# Altium project DisplayPCB.PrjPcb (part 2 of 3)
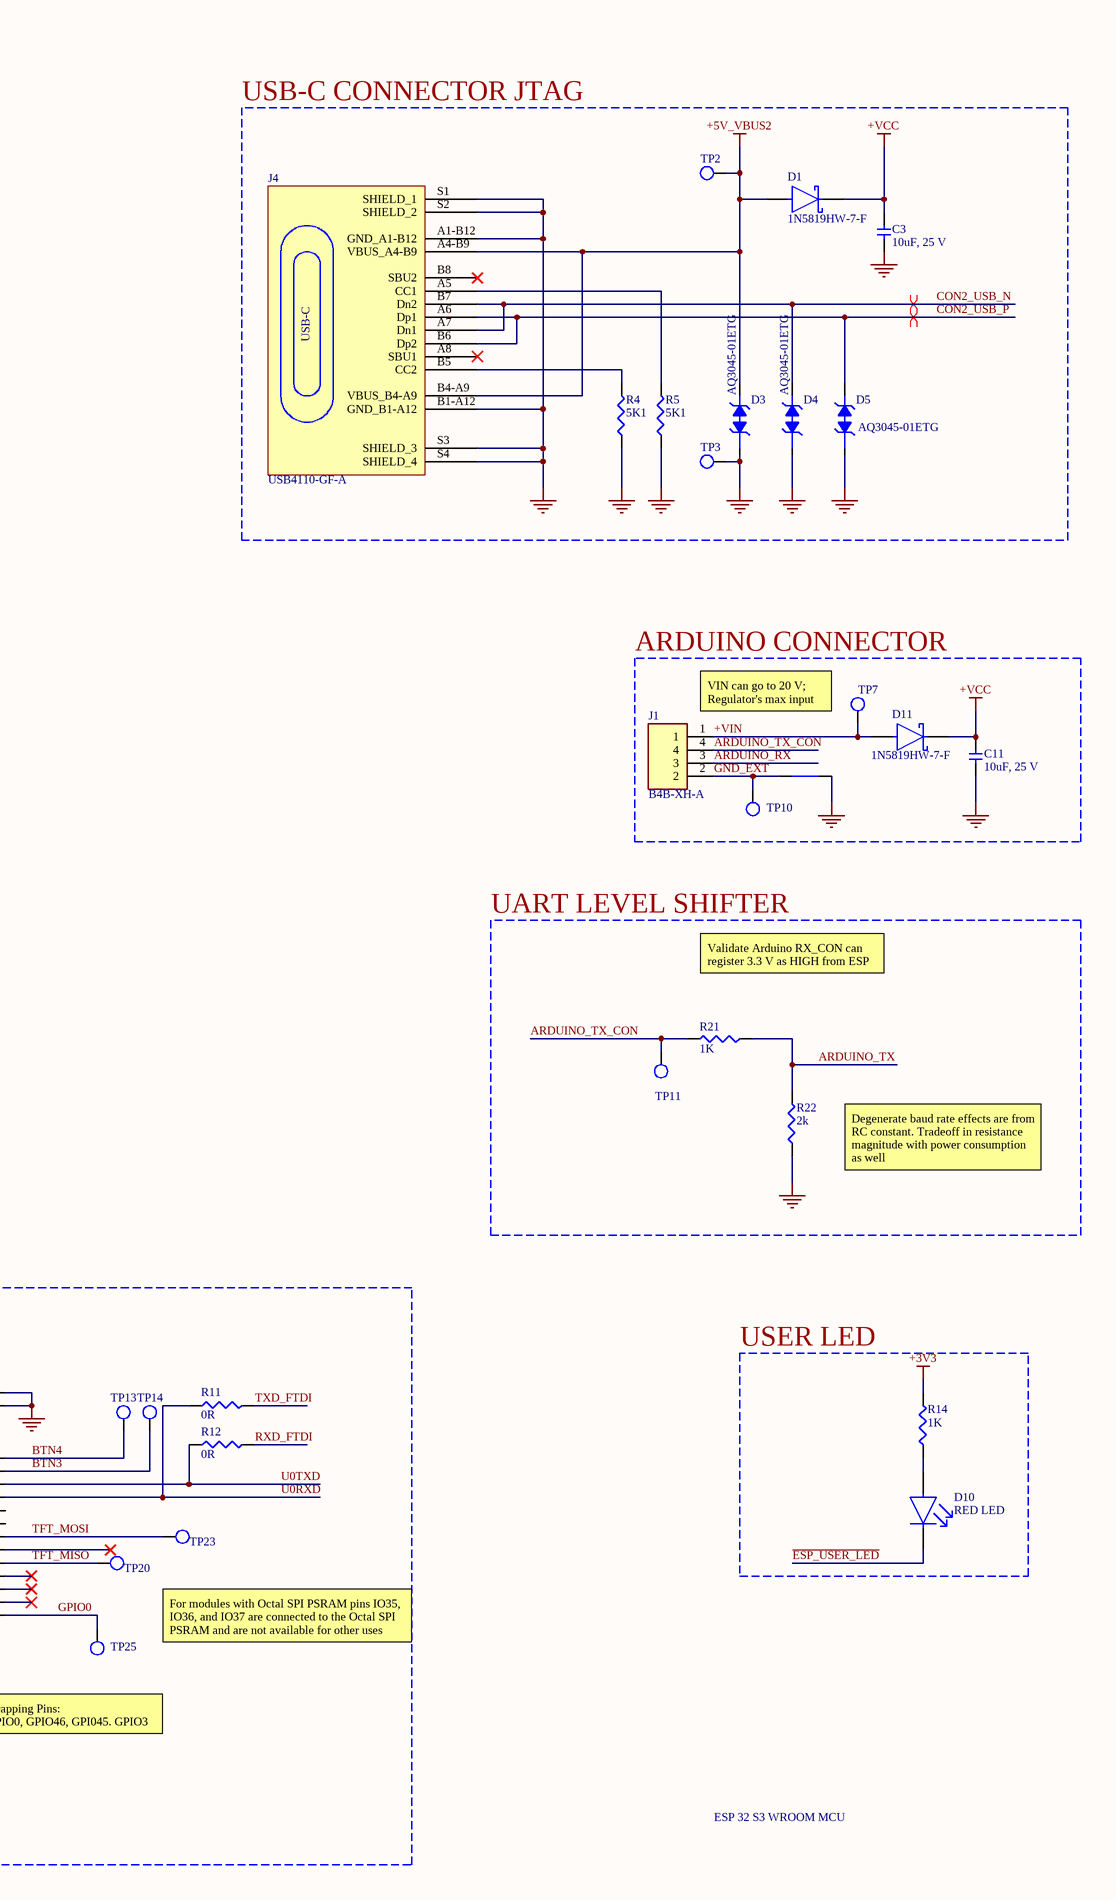
[diagram p4: ESP32_MCU.SchDoc, right]

## Sheet ESP32_MCU.SchDoc (continued)

### Library data of the parts
C1 C5 C7 C15 C17 = 1206B104K500CT: Ceramic Capacitor, Multilayer, Ceramic, 50V, 10% +Tol, 10% -Tol, X7R, 15% TC, 0.1uF, Surface Mount, 1206; Manufacturer: Walsin Technologies; Value: 100nF; Multilayer: Yes; Supplier: Digikey; Supplier Part Number: 1292-1605-1-ND; Manufacturer Part Number: 1206B104K500CT; RoHS: Yes; Category: Ceramic Capacitors; Stock: 1578618; Pricing: 1=0.11, 10=0.061, 100=0.0383, 1000=0.02628 (USD); Mounting Technology: Surface Mount; Pins: 2; Dielectric Material: Ceramic; Package Shape: Rectangular; Case/Package: 1206; Terminal Finish: Nickel; Min Operating Temperature: -55°C; Max Operating Temperature: 125°C; JESD-609 Code: e3; Capacitor Type: Ceramic; Tolerance  (fill in as +-): 10%; Package Style: SMTMeter; Packaging: Tape and Reel; Tolerance (fill in as +-): 10%; Rated DC Voltage (URdc): 50V; Temperature Characteristics Code: X7R; Termination: Wraparound; Length: 3.2mm; Width: 1.6mm; Height: 0.8mm; Reach SVHC Compliant: Yes; RoHS Compliant: Yes; ComponentLink1URL: https://datasheet.ciiva.com:443/pdfs/VipMasterIC/IC/WATC/WATC-S-A0009550342/WATC-S-A0009550342-1.pdf?src-supplier=IHS+Markit; ComponentLink1Description: https://datasheet.ciiva.com:443/pdfs/VipMasterIC/IC/WATC/WATC-S-A0009550342/WATC-S-A0009550342-1.pdf?src-supplier=IHS+Markit; ComponentLink2URL: http://www.farnell.com/datasheets/2340522.pdf?src-supplier=Farnell; ComponentLink2Description: http://www.farnell.com/datasheets/2340522.pdf?src-supplier=Farnell; ComponentLink3URL: http://www.farnell.com/datasheets/2340522.pdf?src-supplier=Newark; ComponentLink3Description: http://www.farnell.com/datasheets/2340522.pdf?src-supplier=Newark; ComponentLink4URL: http://www.passivecomponent.com/wp-content/uploads/2018/10/MLCC.pdf?src-supplier=Digikey; ComponentLink4Description: http://www.passivecomponent.com/wp-content/uploads/2018/10/MLCC.pdf?src-supplier=Digikey; ComponentLink5URL: https://datasheet.octopart.com/1206B104K500CT-Walsin-Technologies-datasheet-85392065.pdf?src-supplier=Element14; ComponentLink5Description: https://datasheet.octopart.com/1206B104K500CT-Walsin-Technologies-datasheet-85392065.pdf?src-supplier=Element14; ComponentLink6URL: http://www.farnell.com/datasheets/1958513.pdf?src-supplier=Element14; ComponentLink6Description: http://www.farnell.com/datasheets/1958513.pdf?src-supplier=Element14; ComponentLink7URL: http://www.farnell.com/datasheets/2340522.pdf?src-supplier=Element14; ComponentLink7Description: http://www.farnell.com/datasheets/2340522.pdf?src-supplier=Element14; ComponentLink8URL: https://www.verical.com/server-webapp/html/getDatasheet?partID=71573&src-supplier=Verical; ComponentLink8Description: https://www.verical.com/server-webapp/html/getDatasheet?partID=71573&src-supplier=Verical; ComponentLink9URL: https://datasheet.octopart.com/1206B104K500CT-Walsin-Technologies-datasheet-128065749.pdf?src-supplier=Future+Electronics; ComponentLink9Description: https://datasheet.octopart.com/1206B104K500CT-Walsin-Technologies-datasheet-128065749.pdf?src-supplier=Future+Electronics; ComponentLink10URL: https://datasheet.octopart.com/1206B104K500CT-Walsin-Technologies-datasheet-62066062.pdf?src-supplier=TME; ComponentLink10Description: https://datasheet.octopart.com/1206B104K500CT-Walsin-Technologies-datasheet-62066062.pdf?src-supplier=TME
C2 C8 = CL31B475KOHNNNE: CAP CER 4.7UF 16V X7R 1206; Manufacturer: Samsung; Dielectric Material: Ceramic; Multilayer: Yes; Tolerance  (fill in as +-): 10%; Supplier: Digikey; Supplier Part Number: 1276-3182-1-ND; Manufacturer Part Number: CL31B475KOHNNNE; RoHS: Yes; Category: Ceramic Capacitors; Stock: 236847; Pricing: 1=0.18, 10=0.103, 100=0.0669, 1000=0.04704 (USD); Mounting Technology: Surface Mount; Pins: 2; Package Shape: Rectangular; Case/Package: 1206; Terminal Finish: Nickel; Min Operating Temperature: -55°C; Max Operating Temperature: 125°C; JESD-609 Code: e3; Value: 4.7uF; Capacitor Type: Ceramic; Package Style: SMTMeter; Packaging: Tape and Reel; Tolerance (fill in as +-): 10%; Rated DC Voltage (URdc): 16V; Temperature Characteristics Code: X7R; Termination: Wraparound; Length: 3.2mm; Width: 1.6mm; Height: 1.8mm; Reach SVHC Compliant: Yes; RoHS Compliant: Yes; ComponentLink1URL: https://datasheet.ciiva.com:443/pdfs/VipMasterIC/IC/SEMS/SEMS-S-A0008522756/SEMS-S-A0008522608-1.pdf?src-supplier=IHS+Markit; ComponentLink1Description: https://datasheet.ciiva.com:443/pdfs/VipMasterIC/IC/SEMS/SEMS-S-A0008522756/SEMS-S-A0008522608-1.pdf?src-supplier=IHS+Markit; ComponentLink2URL: https://datasheet.ciiva.com/15196/getdatasheetpartid-358695-15196064.pdf?src-supplier=Verical; ComponentLink2Description: https://datasheet.ciiva.com/15196/getdatasheetpartid-358695-15196064.pdf?src-supplier=Verical
C3 C4 C9-C11 C14 = TMK316BJ106KL-T: Ceramic Capacitor, Multilayer, Ceramic, 25V, 10% +Tol, 10% -Tol, X5R, 15% TC, 10uF, Surface Mount, 1206; Manufacturer: Taiyo Yuden; Multilayer: Yes; Supplier: Digikey; Supplier Part Number: 587-1337-1-ND; Manufacturer Part Number: TMK316BJ106KL-T; RoHS: Yes; Category: Ceramic Capacitors; Stock: 22102; Pricing: 1=0.12, 10=0.046, 100=0.04, 1000=0.03425 (USD); Mounting Technology: Surface Mount; Pins: 2; Dielectric Material: Ceramic; Package Shape: Rectangular; Case/Package: 1206; Terminal Finish: Nickel; Min Operating Temperature: -55°C; Max Operating Temperature: 85°C; JESD-609 Code: e3; Value: 10uF; Capacitor Type: Ceramic; Tolerance  (fill in as +-): 10%; Package Style: SMTMeter; Packaging: Tape and Reel; Tolerance (fill in as +-): 10%; Rated DC Voltage (URdc): 25V; Temperature Characteristics Code: X5R; Termination: Wraparound; Length: 3.2mm; Width: 1.6mm; Height: 1.6mm; Reach SVHC Compliant: Yes; RoHS Compliant: Yes; ComponentLink1URL: https://datasheet.ciiva.com:443/pdfs/VipMasterIC/IC/TAIY/TAIY-S-A0007939172/TAIY-S-A0007939042-1.pdf?src-supplier=IHS+Markit; ComponentLink1Description: https://datasheet.ciiva.com:443/pdfs/VipMasterIC/IC/TAIY/TAIY-S-A0007939172/TAIY-S-A0007939042-1.pdf?src-supplier=IHS+Markit; ComponentLink2URL: https://datasheet.ciiva.com/7975/1734574-7975841.pdf?src-supplier=Element14; ComponentLink2Description: https://datasheet.ciiva.com/7975/1734574-7975841.pdf?src-supplier=Element14; ComponentLink3URL: https://datasheet.ciiva.com/26936/getdatasheetpartid-782930-26936474.pdf?src-supplier=Verical; ComponentLink3Description: https://datasheet.ciiva.com/26936/getdatasheetpartid-782930-26936474.pdf?src-supplier=Verical; ComponentLink4URL: https://datasheet.ciiva.com/30053/584tmk316bj106kl-t-30053522.pdf?src-supplier=Onlinecomponents.com; ComponentLink4Description: https://datasheet.ciiva.com/30053/584tmk316bj106kl-t-30053522.pdf?src-supplier=Onlinecomponents.com; ComponentLink5URL: https://datasheet.ciiva.com/11601/tmk316bj106kl-t-ss-11601880.pdf?src-supplier=Avnet; ComponentLink5Description: https://datasheet.ciiva.com/11601/tmk316bj106kl-t-ss-11601880.pdf?src-supplier=Avnet; ComponentLink6URL: https://datasheet.ciiva.com/15922/1116tmk316bj106kl-t-15922414.pdf?src-supplier=Onlinecomponents.com; ComponentLink6Description: https://datasheet.ciiva.com/15922/1116tmk316bj106kl-t-15922414.pdf?src-supplier=Onlinecomponents.com; ComponentLink7URL: https://datasheet.ciiva.com/5420/mlcc-all-e-541559-5420143.pdf?src-supplier=Mouser; ComponentLink7Description: https://datasheet.ciiva.com/5420/mlcc-all-e-541559-5420143.pdf?src-supplier=Mouser
C16 = CL31B105KOFNNNE: Ceramic Capacitor, Multilayer, Ceramic, 16V, 10% +Tol, 10% -Tol, X7R, 15% TC, 1uF, Surface Mount, 1206; Manufacturer 1: Samsung; Multilayer: Yes; Supplier 1: Digikey; Manufacturer Part Number 1: CL31B105KOFNNNE; RoHS: Yes; Category: Ceramic Capacitors; Stock 1: 16372; Pricing 1: 1=0.11, 10=0.059, 100=0.037, 1000=0.02531 (USD); Mount: Surface Mount; Number of Pins: 2; Dielectric Material: Ceramic; Package Shape: Rectangular; Size Code: 1206; Terminal Finish: Nickel; Min Operating Temperature: -55°C; Max Operating Temperature: 125°C; JESD-609 Code: e3; Capacitance: 1uF; Capacitor Type: Ceramic; Negative Tolerance: 10%; Package Style: SMTMeter; Packaging: Tape and Reel; Positive Tolerance: 10%; Rated DC Voltage (URdc): 16V; Temperature Characteristics Code: X7R; Termination: Wraparound; Length: 3.2mm; Width: 1.6mm; Height: 1.25mm; Reach SVHC Compliant: Yes; RoHS Compliant: Yes; ComponentLink1URL: https://datasheet.ciiva.com:443/pdfs/VipMasterIC/IC/SEMS/SEMS-S-A0008524868/SEMS-S-A0008524880-1.pdf?src-supplier=IHS+Markit; ComponentLink1Description: https://datasheet.ciiva.com:443/pdfs/VipMasterIC/IC/SEMS/SEMS-S-A0008524868/SEMS-S-A0008524880-1.pdf?src-supplier=IHS+Markit; ComponentLink2URL: https://datasheet.ciiva.com/25798/cl31b105kofnnne-25798673.pdf?src-supplier=Digikey; ComponentLink2Description: https://datasheet.ciiva.com/25798/cl31b105kofnnne-25798673.pdf?src-supplier=Digikey; ComponentLink3URL: https://datasheet.ciiva.com/26838/getdatasheetpartid-358370-26838906.pdf?src-supplier=Verical; ComponentLink3Description: https://datasheet.ciiva.com/26838/getdatasheetpartid-358370-26838906.pdf?src-supplier=Verical; ComponentLink4URL: https://datasheet.ciiva.com/29200/453334-da-01-en-vs-kondensator-1206-29200316.pdf?src-supplier=Conrad; ComponentLink4Description: https://datasheet.ciiva.com/29200/453334-da-01-en-vs-kondensator-1206-29200316.pdf?src-supplier=Conrad; ComponentLink5URL: https://datasheet.ciiva.com/26310/mlcc-catalogdownload2013-eng-26310089.pdf?src-supplier=Distrelec; ComponentLink5Description: https://datasheet.ciiva.com/26310/mlcc-catalogdownload2013-eng-26310089.pdf?src-supplier=Distrelec
D1 D2 D11 = 1N5819HW-7-F: Rectifier Diode, Schottky, 1 Phase, 1 Element, 1A, 40V V(RRM), Silicon; Manufacturer: Diodes; Package Body Material: Plastic; Forward Voltage: 320mV; Non-rep Pk Forward Current-Max: 25A; Number of Elements: 1; Max Power Dissipation: 450mW; Time @ Peak Reflow Temperature-Max (s): 40s; Qualification Status: Not Qualified; Supplier: Digikey; Supplier Part Number: 1N5819HW-FDICT-ND; Manufacturer Part Number: 1N5819HW-7-F; RoHS: Yes; Category: Rectifier Diodes; Stock: 568095; Pricing: 1=0.25, 10=0.17, 100=0.1037, 500=0.09142, 1000=0.08553 (USD); Pins: 2; Diode Element Material: SILICON; Package Shape: Rectangular; Terminal Finish: Tin; Min Operating Temperature: -65°C; Max Operating Temperature: 125°C; JESD-609 Code: e3; Diode Type: RECTIFIER; JESD-30 Code: R-PDSO-G2; Moisture Sensitivity Level: 1; Max Output current: 1A; Package Style: SMALL OUTLINEMeter; Peak Reflow Temperature (Cel): 260°C; Rep Pk Reverse Voltage-Max: 40V; Surface Mount: Yes; Technology: SCHOTTKY; Terminal Form: Gull Wing; Terminal Position: DUAL; Reach SVHC Compliant: Yes; RoHS Compliant: Yes; ComponentLink1URL: https://datasheet.ciiva.com:443/pdfs/VipMasterIC/IC/DIOD/DIOD-S-A0009689747/DIOD-S-A0009691035-1.pdf?src-supplier=IHS+Markit; ComponentLink1Description: https://datasheet.ciiva.com:443/pdfs/VipMasterIC/IC/DIOD/DIOD-S-A0009689747/DIOD-S-A0009691035-1.pdf?src-supplier=IHS+Markit; ComponentLink2URL: https://datasheet.ciiva.com/16303/ds30217-16303296.pdf?src-supplier=Future+Electronics; ComponentLink2Description: https://datasheet.ciiva.com/16303/ds30217-16303296.pdf?src-supplier=Future+Electronics; ComponentLink3URL: https://datasheet.ciiva.com/1177/ds30217-1177089.pdf?src-supplier=Element14; ComponentLink3Description: https://datasheet.ciiva.com/1177/ds30217-1177089.pdf?src-supplier=Element14; ComponentLink4URL: https://datasheet.ciiva.com/912/ds30217-912801.pdf?src-supplier=Digikey; ComponentLink4Description: https://datasheet.ciiva.com/912/ds30217-912801.pdf?src-supplier=Digikey; ComponentLink5URL: https://datasheet.ciiva.com/912/ds30217-912802.pdf?src-supplier=Digikey; ComponentLink5Description: https://datasheet.ciiva.com/912/ds30217-912802.pdf?src-supplier=Digikey; ComponentLink6URL: https://datasheet.ciiva.com/912/ds30217-912803.pdf?src-supplier=Digikey; ComponentLink6Description: https://datasheet.ciiva.com/912/ds30217-912803.pdf?src-supplier=Digikey; ComponentLink7URL: https://datasheet.ciiva.com/8303/ds30217-8303132.pdf?src-supplier=Avnet; ComponentLink7Description: https://datasheet.ciiva.com/8303/ds30217-8303132.pdf?src-supplier=Avnet
D3-D8 = AQ3045-01ETG: Trans Voltage Suppressor Diode, 40W, 5.3V V(RWM), Bidirectional, 1 Element, Silicon, MO-236 / TVS DIODE 5.3VWM 12VC SOD882; Manufacturer 1: Littelfuse; Package Body Material: Plastic; Max Breakdown Voltage: 9V; Min Breakdown Voltage: 6.8V; Number of Elements: 1; Reference Standard: AEC-Q101; Supplier 1: Digikey; Manufacturer Part Number 1: AQ3045-01ETG; RoHS: Yes; Category: TVS Diodes; Stock 1: 14379; Pricing 1: 1=0.46, 10=0.302, 100=0.141, 500=0.134, 1000=0.127, 2000=0.1255, 5000=0.124, 10000=0.111, 20000=0.10638 (USD); Number of Pins: 2; Diode Element Material: SILICON; Package Shape: Rectangular; Min Operating Temperature: -55°C; Max Operating Temperature: 150°C; Polarity: Bidirectional; Diode Type: TRANS VOLTAGE SUPPRESSOR; Non-rep Peak Rev Power Dis-Max: 40W; Package Style: CHIP CARRIERMeter; Rep Pk Reverse Voltage-Max: 5.3V; Surface Mount: Yes; Technology: AVALANCHE; Terminal Form: No Lead; Terminal Position: BOTTOM; Reach SVHC Compliant: Yes; RoHS Compliant: Yes; ComponentLink1URL: https://datasheet.ciiva.com:443/pdfs/VipMasterIC/IC/LFSI/LFSI-S-A0007892042/LFSI-S-A0007892042-1.pdf?src-supplier=IHS+Markit; ComponentLink1Description: https://datasheet.ciiva.com:443/pdfs/VipMasterIC/IC/LFSI/LFSI-S-A0007892042/LFSI-S-A0007892042-1.pdf?src-supplier=IHS+Markit; ComponentLink2URL: http://www.littelfuse.com/~/media/electronics/datasheets/tvs_diode_arrays/littelfuse_tvs_diode_array_aq3045_datasheet.pdf.pdf?src-supplier=Digikey; ComponentLink2Description: http://www.littelfuse.com/~/media/electronics/datasheets/tvs_diode_arrays/littelfuse_tvs_diode_array_aq3045_datasheet.pdf.pdf?src-supplier=Digikey; ComponentLink3URL: https://www.littelfuse.com/~/media/electronics/datasheets/tvs_diode_arrays/littelfuse_tvs_diode_array_aq3045_datasheet.pdf.pdf?src-supplier=Digikey; ComponentLink3Description: https://www.littelfuse.com/~/media/electronics/datasheets/tvs_diode_arrays/littelfuse_tvs_diode_array_aq3045_datasheet.pdf.pdf?src-supplier=Digikey; ComponentLink4URL: https://datasheet.octopart.com/AQ3045-01ETG-Littelfuse-datasheet-101609968.pdf?src-supplier=Farnell; ComponentLink4Description: https://datasheet.octopart.com/AQ3045-01ETG-Littelfuse-datasheet-101609968.pdf?src-supplier=Farnell; ComponentLink5URL: https://datasheet.octopart.com/AQ3045-01ETG-Littelfuse-datasheet-140480283.pdf?src-supplier=Future+Electronics; ComponentLink5Description: https://datasheet.octopart.com/AQ3045-01ETG-Littelfuse-datasheet-140480283.pdf?src-supplier=Future+Electronics
D9 = LTST-C171KGKT: Green 571nm LED Indication - Discrete 2V 0805 (2012 Metric); Manufacturer: Vishay Lite-On; Shape: Rectangular; Lens Style: WATER CLEAR; Forward Current: 30mA; Luminous Intensity-Nom: 35mcd; Channels: 1; Optoelectronic Device Type: SINGLE COLOR LED; Viewing Angle: 130°; Overall Height: 0.8mm; Supplier: Digikey; Supplier Part Number: 160-1426-1-ND; Manufacturer Part Number: LTST-C171KGKT; RoHS: Yes; Stock: 117516; Pricing: 1=0.15, 10=0.105, 100=0.0723, 500=0.05736, 1000=0.05238 (USD); Mounting Technology: Surface Mount; Pins: 2; Color: Green; Terminal Finish: Tin; Min Operating Temperature: -55°C; Max Operating Temperature: 85°C; JESD-609 Code: e3; Packaging: Tape and Reel; Size: 1.4mm; Terminal Pitch: 2.5mm; Reach SVHC Compliant: Yes; RoHS Compliant: Yes; ComponentLink1URL: https://datasheet.ciiva.com:443/pdfs/VipMasterIC/IC/LITE/LITES11816/LITES11816-1.pdf?src-supplier=IHS+Markit; ComponentLink1Description: https://datasheet.ciiva.com:443/pdfs/VipMasterIC/IC/LITE/LITES11816/LITES11816-1.pdf?src-supplier=IHS+Markit; ComponentLink2URL: https://datasheet.ciiva.com/11774/0900766b80dc0298-11774377.pdf?src-supplier=Rs; ComponentLink2Description: https://datasheet.ciiva.com/11774/0900766b80dc0298-11774377.pdf?src-supplier=Rs; ComponentLink3URL: https://datasheet.ciiva.com/12400/lite-on-ltst-c171kgkt-187692-12400799.pdf?src-supplier=Mouser; ComponentLink3Description: https://datasheet.ciiva.com/12400/lite-on-ltst-c171kgkt-187692-12400799.pdf?src-supplier=Mouser; ComponentLink4URL: https://datasheet.ciiva.com/16200/lite-on20ltst-c171kgkt-16200100.pdf?src-supplier=Future+Electronics; ComponentLink4Description: https://datasheet.ciiva.com/16200/lite-on20ltst-c171kgkt-16200100.pdf?src-supplier=Future+Electronics; ComponentLink5URL: https://datasheet.ciiva.com/15118/getdatasheetpartid-214542-15118099.pdf?src-supplier=Verical; ComponentLink5Description: https://datasheet.ciiva.com/15118/getdatasheetpartid-214542-15118099.pdf?src-supplier=Verical; ComponentLink6URL: https://datasheet.ciiva.com/2110/s-110-ltst-c171kgkt-2110072.pdf?src-supplier=Digikey; ComponentLink6Description: https://datasheet.ciiva.com/2110/s-110-ltst-c171kgkt-2110072.pdf?src-supplier=Digikey; ComponentLink7URL: https://datasheet.ciiva.com/2110/s-110-ltst-c171kgkt-2110073.pdf?src-supplier=Digikey; ComponentLink7Description: https://datasheet.ciiva.com/2110/s-110-ltst-c171kgkt-2110073.pdf?src-supplier=Digikey; ComponentLink8URL: https://datasheet.ciiva.com/2110/s-110-ltst-c171kgkt-2110074.pdf?src-supplier=Digikey; ComponentLink8Description: https://datasheet.ciiva.com/2110/s-110-ltst-c171kgkt-2110074.pdf?src-supplier=Digikey
D10 = LTST-C171KRKT: Red 631nm LED Indication - Discrete 2V 0805 (2012 Metric); Manufacturer: Vishay Lite-On; Shape: Rectangular; Lens Style: WATER CLEAR; Forward Current: 30mA; Luminous Intensity-Nom: 54mcd; Channels: 1; Optoelectronic Device Type: SINGLE COLOR LED; Viewing Angle: 130°; Overall Height: 0.8mm; Supplier: Digikey; Supplier Part Number: 160-1427-1-ND; Manufacturer Part Number: LTST-C171KRKT; RoHS: Yes; Category: LEDs; Stock: 198518; Pricing: 1=0.15, 10=0.105, 100=0.0723, 500=0.05736, 1000=0.05238 (USD); Mounting Technology: Surface Mount; Pins: 2; Color: Red; Terminal Finish: Tin; Min Operating Temperature: -55°C; Max Operating Temperature: 85°C; JESD-609 Code: e3; Packaging: Tape and Reel; Size: 1.4mm; Terminal Pitch: 2.5mm; Reach SVHC Compliant: Yes; RoHS Compliant: Yes; ComponentLink1URL: https://datasheet.ciiva.com:443/pdfs/VipMasterIC/IC/LITE/LITES11817/LITES11817-1.pdf?src-supplier=IHS+Markit; ComponentLink1Description: https://datasheet.ciiva.com:443/pdfs/VipMasterIC/IC/LITE/LITES11817/LITES11817-1.pdf?src-supplier=IHS+Markit; ComponentLink2URL: https://datasheet.ciiva.com/11775/0900766b80dc0299-11775643.pdf?src-supplier=Rs; ComponentLink2Description: https://datasheet.ciiva.com/11775/0900766b80dc0299-11775643.pdf?src-supplier=Rs; ComponentLink3URL: https://datasheet.ciiva.com/12403/lite-on-ltst-c171krkt-187201-12403781.pdf?src-supplier=Mouser; ComponentLink3Description: https://datasheet.ciiva.com/12403/lite-on-ltst-c171krkt-187201-12403781.pdf?src-supplier=Mouser; ComponentLink4URL: https://datasheet.ciiva.com/16444/lite-on20ltst-c171krkt-16444779.pdf?src-supplier=Future+Electronics; ComponentLink4Description: https://datasheet.ciiva.com/16444/lite-on20ltst-c171krkt-16444779.pdf?src-supplier=Future+Electronics; ComponentLink5URL: https://datasheet.ciiva.com/2110/s-110-ltst-c171krkt-2110066.pdf?src-supplier=Digikey; ComponentLink5Description: https://datasheet.ciiva.com/2110/s-110-ltst-c171krkt-2110066.pdf?src-supplier=Digikey; ComponentLink6URL: https://datasheet.ciiva.com/2110/s-110-ltst-c171krkt-2110067.pdf?src-supplier=Digikey; ComponentLink6Description: https://datasheet.ciiva.com/2110/s-110-ltst-c171krkt-2110067.pdf?src-supplier=Digikey; ComponentLink7URL: https://datasheet.ciiva.com/2110/s-110-ltst-c171krkt-2110068.pdf?src-supplier=Digikey; ComponentLink7Description: https://datasheet.ciiva.com/2110/s-110-ltst-c171krkt-2110068.pdf?src-supplier=Digikey; Supplier 1: Digikey; Supplier Part Number 1: 160-1415-1-ND
J1 = 455-B4B-XH-A-ND: CONN HEADER VERT 4POS 2.5MM; Manufacturer: JST; Manufacturer Part Number: S4B-PH-K-S; Supplier: Digikey; Supplier Part Number: 455-1721-ND; RoHS: Yes; Category: Headers and Wire Housings; Stock: 152539; Pricing: 1=0.19, 10=0.158, 100=0.134, 500=0.1196, 1000=0.11389, 5000=0.10165, 10000=0.09679 (USD); ComponentLink1URL: https://media.digikey.com/pdf/Data%20Sheets/JST%20PDFs/PH%20Series.pdf?src-supplier=Digikey; ComponentLink1Description: https://media.digikey.com/pdf/Data%20Sheets/JST%20PDFs/PH%20Series.pdf?src-supplier=Digikey; Supplier 1: Digikey; Supplier Part Number 1: 455-B4B-XH-A-ND
J3 J4 = USB4110-GF-A: USB-C (USB TYPE-C) USB 2.0 Receptacle Connector 24 (16+8 Dummy) Position Surface Mount, Right Angle; Manufacturer 1: Global Connector Technology; Supplier 1: Digikey; Manufacturer Part Number 1: USB4110-GF-A; RoHS: No; Category: USB Connectors; Stock 1: 16644; Pricing 1: 1=1.24, 10=1.006, 25=0.9276, 50=0.8722, 100=0.8201, 250=0.75604, 500=0.71098 (USD); ComponentLink1URL: https://datasheet.octopart.com/USB4110-GF-A-Global-Connector-Technology-datasheet-179886649.pdf?src-supplier=Future+Electronics; ComponentLink1Description: https://datasheet.octopart.com/USB4110-GF-A-Global-Connector-Technology-datasheet-179886649.pdf?src-supplier=Future+Electronics; ComponentLink2URL: https://gct.co/files/drawings/usb4110.pdf?src-supplier=Digikey; ComponentLink2Description: https://gct.co/files/drawings/usb4110.pdf?src-supplier=Digikey; ComponentLink3URL: https://datasheet.octopart.com/USB4110-GF-A-GCT-datasheet-166929324.pdf?src-supplier=SOS+electronic; ComponentLink3Description: https://datasheet.octopart.com/USB4110-GF-A-GCT-datasheet-166929324.pdf?src-supplier=SOS+electronic; ComponentLink4URL: https://datasheet.octopart.com/USB4110-GF-A-GCT-datasheet-166933377.pdf?src-supplier=TME; ComponentLink4Description: https://datasheet.octopart.com/USB4110-GF-A-GCT-datasheet-166933377.pdf?src-supplier=TME
NT1-NT3 NT6 NT8 = NetTie_SMD: Net TIE SMD
Q1 Q2 = SS8050-G: Bipolar (BJT) Transistor NPN 25 V 1.5 A 100MHz 300 mW Surface Mount SOT-23-3; Manufacturer: Comchip; Supplier: Digikey; Supplier Part Number: 641-1790-1-ND; Manufacturer Part Number: SS8050-G; RoHS: Yes; Category: Transistors; Stock: 152644; Pricing: 1=0.24, 10=0.148, 100=0.0921, 500=0.06754, 1000=0.05958 (USD); Reach SVHC Compliant: Yes; RoHS Compliant: Yes; ComponentLink1URL: https://datasheet.ciiva.com:443/pdfs/VipMasterIC/IC/COMC/COMC-S-A0004994192/COMC-S-A0004994192-1.pdf?src-supplier=IHS+Markit; ComponentLink1Description: https://datasheet.ciiva.com:443/pdfs/VipMasterIC/IC/COMC/COMC-S-A0004994192/COMC-S-A0004994192-1.pdf?src-supplier=IHS+Markit; ComponentLink2URL: http://www.comchiptech.com/admin/files/product/SS8050-G RevA181526.pdf?src-supplier=Digikey; ComponentLink2Description: http://www.comchiptech.com/admin/files/product/SS8050-G RevA181526.pdf?src-supplier=Digikey
R1 R2 = CRCW080527R4FKEA: RES SMD 27.4 OHM 1% 1/8W 0805; Manufacturer: Vishay; Power: 125mW; Rated Temperature: 70°C; Value: 27.4R; Working Voltage: 150V; Temperature Coefficient (ppm/Cel): 100; Package Height: 0.45mm; Package Length: 2mm; Package Width: 1.25mm; Reference Standard: AEC-Q200; Supplier: Digikey; Supplier Part Number: 541-27.4CCT-ND; Manufacturer Part Number: CRCW080527R4FKEA; RoHS: Yes; Category: Chip SMD Resistors; Stock: 71015; Pricing: 1=0.1, 10=0.039, 50=0.0248, 100=0.0208, 500=0.0143, 1000=0.01238 (USD); Mounting Technology: Surface Mount; Pins: 2; Package Shape: Rectangular; Case/Package: 0805; Terminal Finish: Nickel; Min Operating Temperature: -55°C; Max Operating Temperature: 155°C; Tolerance: 1%; JESD-609 Code: e3; Resistor Type: FIXED RESISTOR; Construction: Chip; Packaging: Tape and Reel; Technology: METAL GLAZE/THICK FILM; Termination: Wraparound; RoHS Compliant: Yes; Reach SVHC Compliant: Yes; ComponentLink1URL: https://datasheet.ciiva.com:443/pdfs/VipMasterIC/IC/VISH/VISH-S-A0007266705/VISH-S-A0007266705-1.pdf?src-supplier=IHS+Markit; ComponentLink1Description: https://datasheet.ciiva.com:443/pdfs/VipMasterIC/IC/VISH/VISH-S-A0007266705/VISH-S-A0007266705-1.pdf?src-supplier=IHS+Markit; ComponentLink2URL: https://datasheet.ciiva.com/11818/0900766b80d98b26-11818212.pdf?src-supplier=Rs; ComponentLink2Description: https://datasheet.ciiva.com/11818/0900766b80d98b26-11818212.pdf?src-supplier=Rs; ComponentLink3URL: https://datasheet.ciiva.com/22708/1697337-22708364.pdf?src-supplier=Element14; ComponentLink3Description: https://datasheet.ciiva.com/22708/1697337-22708364.pdf?src-supplier=Element14; ComponentLink4URL: https://datasheet.ciiva.com/2525/dcrcwe3-2525740.pdf?src-supplier=Digikey; ComponentLink4Description: https://datasheet.ciiva.com/2525/dcrcwe3-2525740.pdf?src-supplier=Digikey; ComponentLink5URL: https://datasheet.ciiva.com/2525/dcrcwe3-2525741.pdf?src-supplier=Digikey; ComponentLink5Description: https://datasheet.ciiva.com/2525/dcrcwe3-2525741.pdf?src-supplier=Digikey; ComponentLink6URL: https://datasheet.ciiva.com/2525/dcrcwe3-2525742.pdf?src-supplier=Digikey; ComponentLink6Description: https://datasheet.ciiva.com/2525/dcrcwe3-2525742.pdf?src-supplier=Digikey; ComponentLink7URL: https://datasheet.ciiva.com/5547/dcrcwe3-109170-5547413.pdf?src-supplier=Mouser; ComponentLink7Description: https://datasheet.ciiva.com/5547/dcrcwe3-109170-5547413.pdf?src-supplier=Mouser; ComponentLink8URL: https://datasheet.ciiva.com/7725/125364-7725886.pdf?src-supplier=Element14; ComponentLink8Description: https://datasheet.ciiva.com/7725/125364-7725886.pdf?src-supplier=Element14; ComponentLink9URL: https://datasheet.ciiva.com/7732/1697337-7732095.pdf?src-supplier=Element14; ComponentLink9Description: https://datasheet.ciiva.com/7732/1697337-7732095.pdf?src-supplier=Element14; ComponentLink10URL: https://datasheet.ciiva.com/16435/dcrcw-16435916.pdf?src-supplier=Future+Electronics; ComponentLink10Description: https://datasheet.ciiva.com/16435/dcrcw-16435916.pdf?src-supplier=Future+Electronics
R3 R11 R12 R15 R16 = CR0805AJ/-000EAS: 0 Ohms Jumper Chip Resistor 0805 (2012 Metric) Anti-Sulfur, Automotive AEC-Q200, Moisture Resistant Thick Film; Manufacturer: Bourns; Supplier: Digikey; Supplier Part Number: CR0805AJ/-000EASCT-ND; Manufacturer Part Number: CR0805AJ/-000EAS; RoHS: Yes; Category: Chip SMD Resistors; Stock: 34544; Pricing: 1=0.1, 10=0.034, 50=0.0212, 100=0.0177, 500=0.01208, 1000=0.01043 (USD); ComponentLink1URL: https://datasheet.ciiva.com:443/pdfs/VipMasterIC/IC/BOUR/BOUR-S-A0008933277/BOUR-S-A0008933277-1.pdf?src-supplier=IHS+Markit; ComponentLink1Description: https://datasheet.ciiva.com:443/pdfs/VipMasterIC/IC/BOUR/BOUR-S-A0008933277/BOUR-S-A0008933277-1.pdf?src-supplier=IHS+Markit; ComponentLink2URL: https://www.bourns.com/docs/product-datasheets/crxxxxa-as.pdf?src-supplier=Digikey; ComponentLink2Description: https://www.bourns.com/docs/product-datasheets/crxxxxa-as.pdf?src-supplier=Digikey; ComponentLink3URL: https://datasheet.octopart.com/CR0805AJ--000EAS-Bourns-datasheet-166097895.pdf?src-supplier=Electro+Sonic; ComponentLink3Description: https://datasheet.octopart.com/CR0805AJ--000EAS-Bourns-datasheet-166097895.pdf?src-supplier=Electro+Sonic
R4-R7 = RC0805JR-075K1L: RES 5.1K OHM 5% 1/8W 0805; Manufacturer: Yageo; Rated Temperature: 70°C; Working Voltage: 150V; Temperature Coefficient (ppm/Cel): 100; Package Height: 0.5mm; Package Length: 2mm; Package Width: 1.25mm; Additional Feature: LASER TRIMMABLE; Power: 125mW; Value: 5.1kR; RoHS: Yes; Category: Chip SMD Resistors; Package Shape: Rectangular; Terminal Finish: Nickel; Min Operating Temperature: -55°C; Max Operating Temperature: 155°C; Tolerance: 5%; JESD-609 Code: e3; Resistor Type: FIXED RESISTOR; Construction: Chip; Packaging: Tape and Reel; Technology: METAL GLAZE/THICK FILM; Termination: Wraparound; Reach SVHC Compliant: Yes; RoHS Compliant: Yes; ComponentLink1URL: https://datasheet.ciiva.com:443/pdfs/VipMasterIC/IC/YAGO/YAGO-S-A0008145938/YAGO-S-A0008145938-1.pdf?src-supplier=IHS+Markit; ComponentLink1Description: https://datasheet.ciiva.com:443/pdfs/VipMasterIC/IC/YAGO/YAGO-S-A0008145938/YAGO-S-A0008145938-1.pdf?src-supplier=IHS+Markit; ComponentLink2URL: https://datasheet.ciiva.com/2456/pyu-r-int-thick-7-2456155.pdf?src-supplier=Digikey; ComponentLink2Description: https://datasheet.ciiva.com/2456/pyu-r-int-thick-7-2456155.pdf?src-supplier=Digikey; ComponentLink3URL: https://datasheet.ciiva.com/2456/pyu-r-int-thick-7-2456156.pdf?src-supplier=Digikey; ComponentLink3Description: https://datasheet.ciiva.com/2456/pyu-r-int-thick-7-2456156.pdf?src-supplier=Digikey; ComponentLink4URL: https://datasheet.ciiva.com/2456/pyu-r-int-thick-7-2456157.pdf?src-supplier=Digikey; ComponentLink4Description: https://datasheet.ciiva.com/2456/pyu-r-int-thick-7-2456157.pdf?src-supplier=Digikey; Supplier: Digikey; Supplier Part Number: 311-5.1KARCT-ND; Manufacturer Part Number: RC0805JR-075K1L; Stock: 555886; Pricing: 1=0.1, 10=0.008, 50=0.0072, 100=0.0061 (USD); Mounting Technology: Surface Mount; Pins: 2; Case/Package: 0805; ComponentLink5URL: https://datasheet.ciiva.com/12577/rc0805-12577711.pdf?src-supplier=Mouser; ComponentLink5Description: https://datasheet.ciiva.com/12577/rc0805-12577711.pdf?src-supplier=Mouser
R8 = RC0805JR-075K1L: RES 5.1K OHM 5% 1/8W 0805; Manufacturer: Yageo; Additional Feature: LASER TRIMMABLE; Power: 125mW; Rated Temperature: 70°C; Value: 5.1kR; Working Voltage: 150V; Temperature Coefficient (ppm/Cel): 100; Package Height: 0.5mm; Package Length: 2mm; Package Width: 1.25mm; Supplier: Digikey; Supplier Part Number: 311-5.1KARCT-ND; Manufacturer Part Number: RC0805JR-075K1L; RoHS: Yes; Category: Chip SMD Resistors; Stock: 555886; Pricing: 1=0.1, 10=0.008, 50=0.0072, 100=0.0061 (USD); Mounting Technology: Surface Mount; Pins: 2; Package Shape: Rectangular; Case/Package: 0805; Terminal Finish: Nickel; Min Operating Temperature: -55°C; Max Operating Temperature: 155°C; Tolerance: 5%; JESD-609 Code: e3; Resistor Type: FIXED RESISTOR; Construction: Chip; Packaging: Tape and Reel; Technology: METAL GLAZE/THICK FILM; Termination: Wraparound; Reach SVHC Compliant: Yes; RoHS Compliant: Yes; ComponentLink1URL: https://datasheet.ciiva.com:443/pdfs/VipMasterIC/IC/YAGO/YAGO-S-A0008145938/YAGO-S-A0008145938-1.pdf?src-supplier=IHS+Markit; ComponentLink1Description: https://datasheet.ciiva.com:443/pdfs/VipMasterIC/IC/YAGO/YAGO-S-A0008145938/YAGO-S-A0008145938-1.pdf?src-supplier=IHS+Markit; ComponentLink2URL: https://datasheet.ciiva.com/2456/pyu-r-int-thick-7-2456155.pdf?src-supplier=Digikey; ComponentLink2Description: https://datasheet.ciiva.com/2456/pyu-r-int-thick-7-2456155.pdf?src-supplier=Digikey; ComponentLink3URL: https://datasheet.ciiva.com/2456/pyu-r-int-thick-7-2456156.pdf?src-supplier=Digikey; ComponentLink3Description: https://datasheet.ciiva.com/2456/pyu-r-int-thick-7-2456156.pdf?src-supplier=Digikey; ComponentLink4URL: https://datasheet.ciiva.com/2456/pyu-r-int-thick-7-2456157.pdf?src-supplier=Digikey; ComponentLink4Description: https://datasheet.ciiva.com/2456/pyu-r-int-thick-7-2456157.pdf?src-supplier=Digikey; ComponentLink5URL: https://datasheet.ciiva.com/12577/rc0805-12577711.pdf?src-supplier=Mouser; ComponentLink5Description: https://datasheet.ciiva.com/12577/rc0805-12577711.pdf?src-supplier=Mouser
R9 R10 R13 = RMCF0805FT10K0: Fixed Resistor, Metal Glaze/thick Film, 0.125W, 10000ohm, 150V, 1% +/-Tol, 100ppm/Cel, Surface Mount, 0805; Manufacturer 1: Stackpole Electronics; Rated Power Dissipation (P): 125mW; Rated Temperature: 70°C; Resistance: 10kR; Temperature Coefficient (ppm/Cel): 100; Package Height: 0.5mm; Package Length: 2mm; Package Width: 1.25mm; Reference Standard: AEC-Q200; Supplier 1: Digikey; Manufacturer Part Number 1: RMCF0805FT10K0; RoHS: Yes; Category: Chip SMD Resistors; Stock 1: 928178; Pricing 1: 1=0.1, 10=0.025, 100=0.012, 1000=0.00658, 2500=0.00564 (USD); Mount: Surface Mount; Number of Pins: 2; Package Shape: Rectangular; Size Code: 0805; Terminal Finish: Nickel; Min Operating Temperature: -55°C; Max Operating Temperature: 155°C; Tolerance: 1%; JESD-609 Code: e3; Resistor Type: FIXED RESISTOR; Construction: Rectangular; Packaging: Tape and Reel; Technology: METAL GLAZE/THICK FILM; Termination: Wraparound; Working Voltage: 150V; Reach SVHC Compliant: Yes; RoHS Compliant: Yes; ComponentLink1URL: https://datasheet.ciiva.com:443/pdfs/VipMasterIC/IC/SEIE/SEIE-S-A0009541969/SEIE-S-A0009541969-1.pdf?src-supplier=IHS+Markit; ComponentLink1Description: https://datasheet.ciiva.com:443/pdfs/VipMasterIC/IC/SEIE/SEIE-S-A0009541969/SEIE-S-A0009541969-1.pdf?src-supplier=IHS+Markit; ComponentLink2URL: https://datasheet.ciiva.com/15193/getdatasheetpartid-362046-15193525.pdf?src-supplier=Verical; ComponentLink2Description: https://datasheet.ciiva.com/15193/getdatasheetpartid-362046-15193525.pdf?src-supplier=Verical
R14 R21 = RC0805FR-071KL: RES 1K OHM 1% 1/8W 0805; Manufacturer: Yageo; Additional Feature: LASER TRIMMABLE; Power: 125mW; Rated Temperature: 70°C; Value: 1kR; Working Voltage: 150V; Temperature Coefficient (ppm/Cel): 100; Package Height: 0.5mm; Package Length: 2mm; Package Width: 1.25mm; Supplier: Digikey; Supplier Part Number: 311-1.00KCRCT-ND; Manufacturer Part Number: RC0805FR-071KL; RoHS: Yes; Category: Chip SMD Resistors; Stock: 932567; Pricing: 1=0.1, 10=0.012, 100=0.0092, 1000=0.00714, 5000=0.00408, 10000=0.00396, 15000=0.00374, 25000=0.00356 (USD); Mounting Technology: Surface Mount; Pins: 2; Package Shape: Rectangular; Case/Package: 0805; Terminal Finish: Nickel; Min Operating Temperature: -55°C; Max Operating Temperature: 155°C; Tolerance: 1%; JESD-609 Code: e3; Resistor Type: FIXED RESISTOR; Construction: Chip; Packaging: Tape and Reel; Technology: METAL GLAZE/THICK FILM; Termination: Wraparound; Reach SVHC Compliant: Yes; RoHS Compliant: Yes; ComponentLink1URL: https://datasheet.ciiva.com:443/pdfs/VipMasterIC/IC/YAGO/YAGO-S-A0008145938/YAGO-S-A0008145938-1.pdf?src-supplier=IHS+Markit; ComponentLink1Description: https://datasheet.ciiva.com:443/pdfs/VipMasterIC/IC/YAGO/YAGO-S-A0008145938/YAGO-S-A0008145938-1.pdf?src-supplier=IHS+Markit
R22 = CRCW08052K00FKEA: Fixed Resistor, Metal Glaze/thick Film, 0.125W, 2000ohm, 150V, 1% +/-Tol, 100ppm/Cel, Surface Mount, 0805; Manufacturer: Vishay; Power: 125mW; Value: 2kR; Temperature Coefficient (ppm/Cel): 100; Rated Temperature: 70°C; Package Height: 0.45mm; Package Length: 2mm; Package Width: 1.25mm; Reference Standard: AEC-Q200; Supplier: Digikey; Supplier Part Number: 541-2.00KCCT-ND; Manufacturer Part Number: CRCW08052K00FKEA; RoHS: Yes; Category: Chip SMD Resistors; Stock: 21507; Pricing: 1=0.1, 10=0.042, 100=0.0217, 1000=0.01279, 2500=0.0108 (USD); Mounting Technology: Surface Mount; Pins: 2; Case/Package: 0805; Terminal Finish: Nickel; Package Shape: Rectangular; Min Operating Temperature: -55°C; Max Operating Temperature: 155°C; Tolerance: 1%; Resistor Type: FIXED RESISTOR; Packaging: Tape and Reel; Working Voltage: 150V; Technology: METAL GLAZE/THICK FILM; Termination: Wraparound; Construction: Chip; JESD-609 Code: e3; RoHS Compliant: Yes; Reach SVHC Compliant: Yes; ComponentLink1URL: https://datasheet.ciiva.com:443/pdfs/VipMasterIC/IC/VISH/VISH-S-A0007266705/VISH-S-A0007266705-1.pdf?src-supplier=IHS+Markit; ComponentLink1Description: https://datasheet.ciiva.com:443/pdfs/VipMasterIC/IC/VISH/VISH-S-A0007266705/VISH-S-A0007266705-1.pdf?src-supplier=IHS+Markit; ComponentLink2URL: https://datasheet.ciiva.com/9093/dcrcwe3-9093501.pdf?src-supplier=Avnet; ComponentLink2Description: https://datasheet.ciiva.com/9093/dcrcwe3-9093501.pdf?src-supplier=Avnet; ComponentLink3URL: https://datasheet.ciiva.com/2467/dcrcwe3-2467164.pdf?src-supplier=Digikey; ComponentLink3Description: https://datasheet.ciiva.com/2467/dcrcwe3-2467164.pdf?src-supplier=Digikey; ComponentLink4URL: https://datasheet.ciiva.com/2467/dcrcwe3-2467165.pdf?src-supplier=Digikey; ComponentLink4Description: https://datasheet.ciiva.com/2467/dcrcwe3-2467165.pdf?src-supplier=Digikey; ComponentLink5URL: https://datasheet.ciiva.com/2467/dcrcwe3-2467166.pdf?src-supplier=Digikey; ComponentLink5Description: https://datasheet.ciiva.com/2467/dcrcwe3-2467166.pdf?src-supplier=Digikey; ComponentLink6URL: https://datasheet.ciiva.com/16772/70201119-16772086.pdf?src-supplier=Allied+Electronics; ComponentLink6Description: https://datasheet.ciiva.com/16772/70201119-16772086.pdf?src-supplier=Allied+Electronics; ComponentLink7URL: https://datasheet.ciiva.com/16199/dcrcwe3-16199147.pdf?src-supplier=Future+Electronics; ComponentLink7Description: https://datasheet.ciiva.com/16199/dcrcwe3-16199147.pdf?src-supplier=Future+Electronics; ComponentLink8URL: https://datasheet.ciiva.com/5547/dcrcwe3-109170-5547611.pdf?src-supplier=Mouser; ComponentLink8Description: https://datasheet.ciiva.com/5547/dcrcwe3-109170-5547611.pdf?src-supplier=Mouser; ComponentLink9URL: https://datasheet.ciiva.com/15158/getdatasheetpartid-246953-15158870.pdf?src-supplier=Verical; ComponentLink9Description: https://datasheet.ciiva.com/15158/getdatasheetpartid-246953-15158870.pdf?src-supplier=Verical; ComponentLink10URL: https://datasheet.ciiva.com/7673/1697337-7673343.pdf?src-supplier=Element14; ComponentLink10Description: https://datasheet.ciiva.com/7673/1697337-7673343.pdf?src-supplier=Element14; ComponentLink11URL: https://datasheet.ciiva.com/7673/1720486-7673482.pdf?src-supplier=Element14; ComponentLink11Description: https://datasheet.ciiva.com/7673/1720486-7673482.pdf?src-supplier=Element14; ComponentLink12URL: https://datasheet.ciiva.com/7673/1720486-7673483.pdf?src-supplier=Element14; ComponentLink12Description: https://datasheet.ciiva.com/7673/1720486-7673483.pdf?src-supplier=Element14
SW1 SW2 = PTS645SH50SMTR92 LFS: Tactile Switch SPST-NO Top Actuated Surface Mount; Manufacturer 1: ITT C&K; Manufacturer Part Number 1: PTS645SM43SMTR92LFS; Actuator Type: Pushbutton; Contact Current(DC)-Max: 50mA; Contact DC Max Rating R Load: 0.05A@12VDC; Contact Resistance: 0.1mR; Contact Voltage(DC)-Max: 12V; Dielectric Withstand Volts: 250VACV; Insulation Resistance: 100GR; PCB Hole Count: 4; Switch Action: MOMENTARY; Switch Function: SPST; Switch Type: Keypad; Body Breadth: 5.9944mm; Body Height: 3.4544mm; RoHS: Yes; Category: Tactile Switches; Stock 1: 178618; Pricing 1: 1=0.37, 10=0.299, 25=0.2756, 100=0.243, 250=0.22348, 500=0.2096 (USD); Mount: Surface Mount; Terminal Finish: Silver; Min Operating Temperature: -20°C; Max Operating Temperature: 60°C; JESD-609 Code: e4; Termination: Solder; Body Length or Diameter: 5.9944mm; Terminal Length: 0.138inch; Reach SVHC Compliant: Yes; RoHS Compliant: Yes; ComponentLink1URL: https://datasheet.ciiva.com:443/pdfs/VipMasterIC/IC/CKCI/CKCI-S-A0001796527/CKCI-S-A0001796842-1.pdf?src-supplier=IHS+Markit; ComponentLink1Description: https://datasheet.ciiva.com:443/pdfs/VipMasterIC/IC/CKCI/CKCI-S-A0001796527/CKCI-S-A0001796842-1.pdf?src-supplier=IHS+Markit; ComponentLink2URL: https://datasheet.ciiva.com/29903/getdatasheetpartid-786341-29903846.pdf?src-supplier=Verical; ComponentLink2Description: https://datasheet.ciiva.com/29903/getdatasheetpartid-786341-29903846.pdf?src-supplier=Verical; ComponentLink3URL: https://datasheet.ciiva.com/29931/getdatasheetpartid-764615-29931183.pdf?src-supplier=Verical; ComponentLink3Description: https://datasheet.ciiva.com/29931/getdatasheetpartid-764615-29931183.pdf?src-supplier=Verical; ComponentLink4URL: https://datasheet.ciiva.com/14920/pts645-14920733.pdf?src-supplier=Digikey; ComponentLink4Description: https://datasheet.ciiva.com/14920/pts645-14920733.pdf?src-supplier=Digikey; ComponentLink5URL: https://datasheet.ciiva.com/14920/pts645-14920734.pdf?src-supplier=Digikey; ComponentLink5Description: https://datasheet.ciiva.com/14920/pts645-14920734.pdf?src-supplier=Digikey; ComponentLink6URL: https://datasheet.ciiva.com/14920/pts645-14920735.pdf?src-supplier=Digikey; ComponentLink6Description: https://datasheet.ciiva.com/14920/pts645-14920735.pdf?src-supplier=Digikey; Supplier 1: Digikey; Supplier Part Number 1: CKN9085CT-ND
TP1-TP14 TP16-TP26 TP30 TP32 = CMP-108-0001-3: Generic Test Point
U1 = ESP32-S3-WROOM-1(N16R8): RF TXRX MOD BT WIFI PCB TH SMD; Manufacturer: Espressif Systems; Supplier: Digikey; Supplier Part Number: 1965-ESP32-S3-WROOM-1-N16R8CT-ND; Manufacturer Part Number: ESP32-S3-WROOM-1(N16R8); RoHS: No; Category: LDO; Stock: 2632; Pricing: 1=3.9, 650=3.90002 (USD); ComponentLink1URL: https://datasheet.octopart.com/ESP32-S3-WROOM-1-N16R8-Espressif-Systems-datasheet-165560563.pdf?src-supplier=TME; ComponentLink1Description: https://datasheet.octopart.com/ESP32-S3-WROOM-1-N16R8-Espressif-Systems-datasheet-165560563.pdf?src-supplier=TME
U2 = FT231XS-R: IC USB SERIAL FULL UART 20SSOP; Manufacturer: FTDI; Package Body Material: Plastic; Package Equivalence Code: SSOP20,.25; Power Supplies: 3.3/5V; Max Supply Current: 8.4mA; Max Supply Voltage: 5.5V; Min Supply Voltage: 2.97V; Nominal Supply Voltage: 5V; Qualification Status: Not Qualified; Supplier: Digikey; Supplier Part Number: 768-1129-6-ND; Manufacturer Part Number: FT231XS-R; RoHS: Yes; Category: Interface ICs; Stock: 24743; Pricing: 1=2.34, 25=2.27, 100=2.2, 250=2, 500=1.825 (USD); Case/Package: SSOP; Pins: 20; Package Shape: Rectangular; Terminal Finish: Tin; Min Operating Temperature: -40°C; Max Operating Temperature: 85°C; JESD-609 Code: e3; JESD-30 Code: R-PDSO-G20; Moisture Sensitivity Level: 3; Package Style: SMALL OUTLINE, SHRINK PITCHMeter; Surface Mount: Yes; Technology: CMOS; Terminal Form: Gull Wing; Terminal Position: DUAL; Length: 8.6614mm; Width: 3.9116mm; Height - Seated (Max): 1.7526mm; Terminal Pitch: 0.635mm; Temperature Grade: INDUSTRIAL; Reach SVHC Compliant: Yes; RoHS Compliant: Yes; ComponentLink1URL: https://datasheet.ciiva.com:443/pdfs/VipMasterIC/IC/FTDI/FTDIS00099/FTDIS00099-1.pdf?src-supplier=IHS+Markit; ComponentLink1Description: https://datasheet.ciiva.com:443/pdfs/VipMasterIC/IC/FTDI/FTDIS00099/FTDIS00099-1.pdf?src-supplier=IHS+Markit; ComponentLink2URL: https://datasheet.ciiva.com/30478/0900766b811020d3-30478147.pdf?src-supplier=Rs; ComponentLink2Description: https://datasheet.ciiva.com/30478/0900766b811020d3-30478147.pdf?src-supplier=Rs; ComponentLink3URL: https://datasheet.ciiva.com/1787/ft-x-series-1787028.pdf?src-supplier=Digikey; ComponentLink3Description: https://datasheet.ciiva.com/1787/ft-x-series-1787028.pdf?src-supplier=Digikey; ComponentLink4URL: https://datasheet.ciiva.com/1787/ft-x-series-1787029.pdf?src-supplier=Digikey; ComponentLink4Description: https://datasheet.ciiva.com/1787/ft-x-series-1787029.pdf?src-supplier=Digikey; ComponentLink5URL: https://datasheet.ciiva.com/1787/ft-x-series-1787030.pdf?src-supplier=Digikey; ComponentLink5Description: https://datasheet.ciiva.com/1787/ft-x-series-1787030.pdf?src-supplier=Digikey; ComponentLink6URL: https://datasheet.ciiva.com/48909/70403932-48909078.pdf?src-supplier=Allied+Electronics; ComponentLink6Description: https://datasheet.ciiva.com/48909/70403932-48909078.pdf?src-supplier=Allied+Electronics
U3 = TL1963A-33DCYR: Linear Voltage Regulator IC Positive Fixed 1 Output 1.5A SOT-223-4; Manufacturer: Texas Instruments; Package Body Material: Plastic; Dropout Voltage1-Max: 550mV; Dropout Voltage1-Nom: 340mV; Input Voltage Absolute-Max: 20V; Min Input Voltage: 3.8V; Channels: 1; Output Voltage1-Max: 3.4V; Output Voltage1-Min: 3.2V; Output Voltage1-Nom: 3.3V; Regulator Type: FIXED POSITIVE SINGLE OUTPUT LDO REGULATOR; Voltage Tolerance-Max: 3%; Qualification Status: Not Qualified; Supplier: Digikey; Supplier Part Number: 296-24897-1-ND; Manufacturer Part Number: TL1963A-33DCYR; RoHS: Yes; Category: Voltage Regulators - Linear; Stock: 5722; Pricing: 1=2.77, 10=2.069, 25=1.8936, 100=1.7, 250=1.60772, 500=1.55212, 1000=1.50634, 2500=1.45802, 5000=1.4289 (USD); Case/Package: SOP; Pins: 4; Package Shape: Rectangular; Terminal Finish: Tin; JESD-609 Code: e3; Adjustability: FIXED; Max Supply Voltage: 20V; JESD-30 Code: R-PDSO-G4; Moisture Sensitivity Level: 2; Number of Outputs: 1; Operating Temperature, TJ-Max: 125°C; Operating Temperature, TJ-Min: -40°C; Output Current1-Max: 1.5A; Packaging: Tape and Reel; Peak Reflow Temperature (Cel): 260°C; Surface Mount: Yes; Technology: BIPOLAR; Terminal Form: Gull Wing; Terminal Position: DUAL; Length: 6.5mm; Width: 3.5mm; Height - Seated (Max): 1.8mm; Terminal Pitch: 2.3mm; Reach SVHC Compliant: Yes; RoHS Compliant: Yes; ComponentLink1URL: https://www.ti.com:443/lit/ds/symlink/tl1963a.pdf?src-supplier=IHS+Markit; ComponentLink1Description: https://www.ti.com:443/lit/ds/symlink/tl1963a.pdf?src-supplier=IHS+Markit; ComponentLink2URL: https://datasheet.ciiva.com/2046/-2046068.pdf?src-supplier=Digikey; ComponentLink2Description: https://datasheet.ciiva.com/2046/-2046068.pdf?src-supplier=Digikey